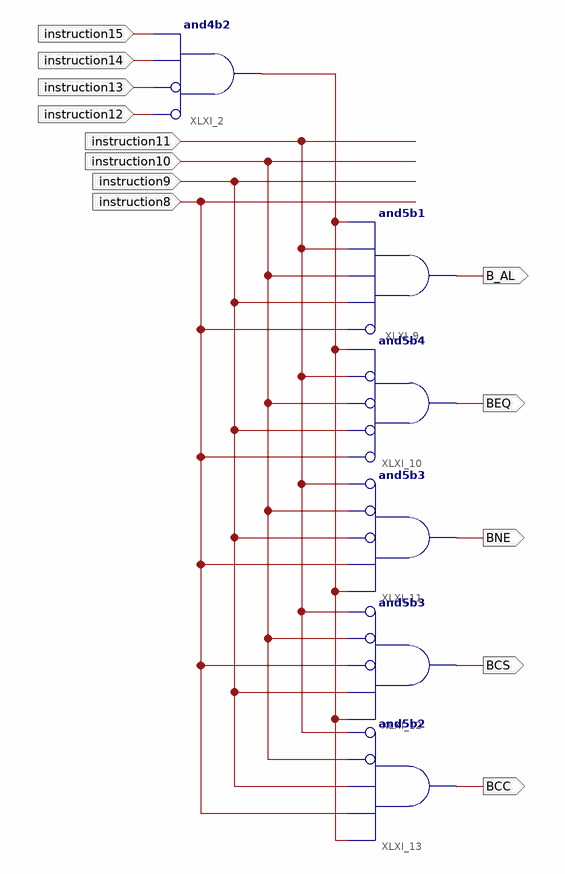
[diagram p0: schematic sheet 1]
// Xilinx ISE schematic insB.sch (spartan6) as structural Verilog: 6 symbols, 13 ports
module insB (
  input  instruction12,
  input  instruction15,
  input  instruction14,
  input  instruction13,
  input  instruction11,
  input  instruction9,
  input  instruction10,
  input  instruction8,
  output B_AL,
  output BEQ,
  output BNE,
  output BCS,
  output BCC
);

  wire XLXN_52;

  and XLXI_2 (XLXN_52, ~instruction12, ~instruction13, instruction14, instruction15);  // and4b2
  and XLXI_9 (B_AL, ~instruction8, instruction9, instruction10, instruction11, XLXN_52);  // and5b1
  and XLXI_10 (BEQ, ~instruction8, ~instruction9, ~instruction10, ~instruction11, XLXN_52);  // and5b4
  and XLXI_11 (BNE, ~instruction11, ~instruction10, ~instruction9, instruction8, XLXN_52);  // and5b3
  and XLXI_12 (BCS, ~instruction11, ~instruction10, ~instruction8, instruction9, XLXN_52);  // and5b3
  and XLXI_13 (BCC, ~instruction11, ~instruction10, instruction9, instruction8, XLXN_52);  // and5b2
endmodule
